# EAGLE design led-tester (EAGLE 7.3.0)
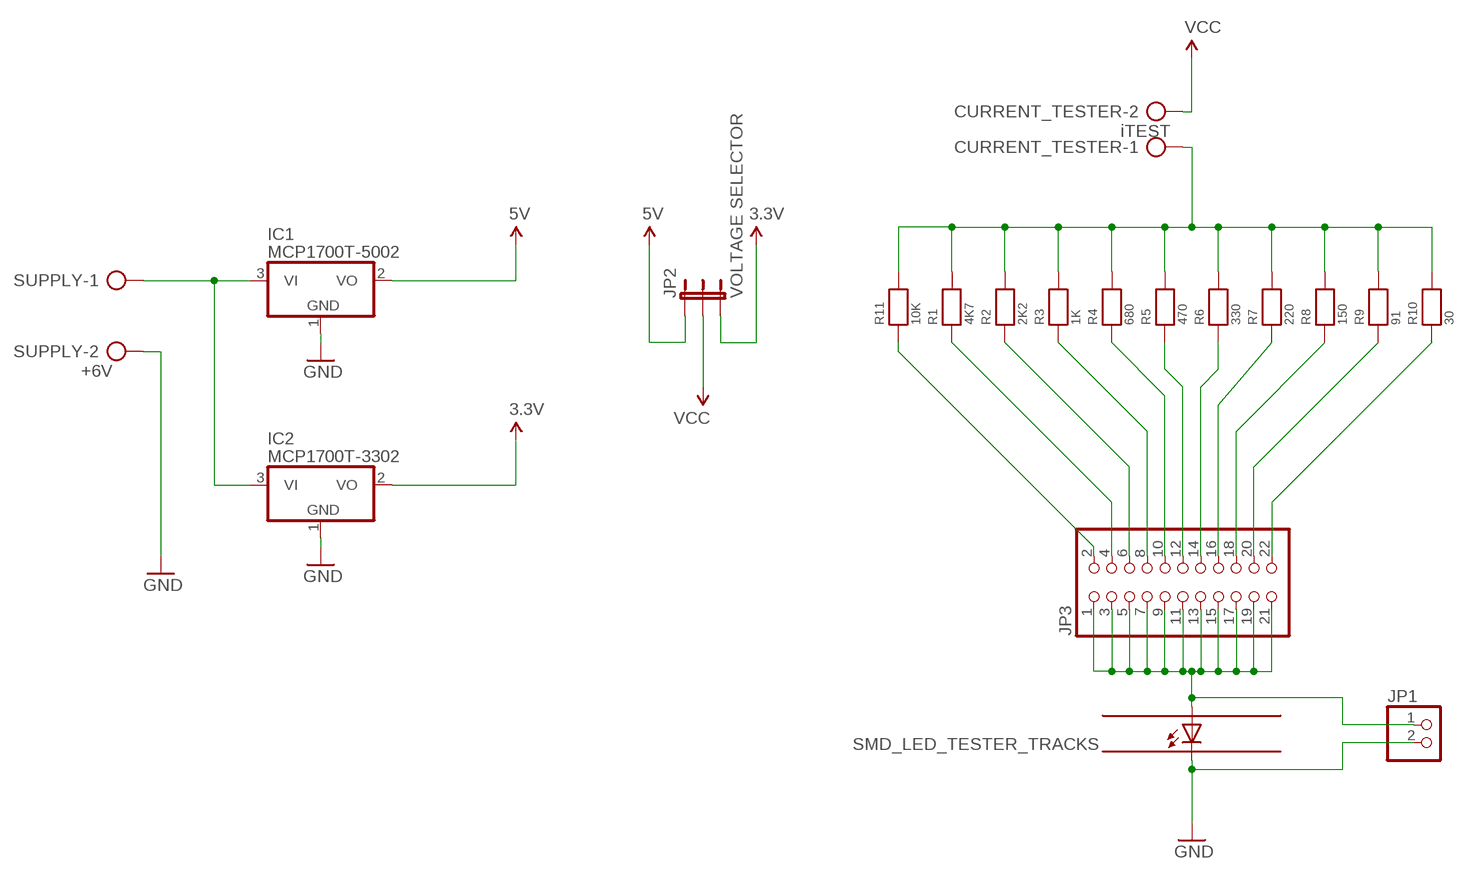
[diagram p0: schematic, sheet 1]

## Parts
CURRENT_TESTER  iTEST  TERMINAL_BLOCK_X2  [TERMINAL_BLOCK_X2]
IC1  MCP1700T-5002  MCP1703CB  [SOT23]
IC2  MCP1700T-3302  MCP1703CB  [SOT23]
JP1  PINHD-1X2  [1X02]
JP2  VOLTAGE SELECTOR  JUMPER-3PTH  [1X03]
JP3  PINHD-2X11  [2X11]
R1  4K7  RESISTOR0805  [0805]
R2  2K2  RESISTOR0805  [0805]
R3  1K  RESISTOR0805  [0805]
R4  680  RESISTOR0805  [0805]
R5  470  RESISTOR0805  [0805]
R6  330  RESISTOR0805  [0805]
R7  220  RESISTOR0805  [0805]
R8  150  RESISTOR0805  [0805]
R9  91  RESISTOR0805  [0805]
R10  30  RESISTOR0805  [0805]
R11  10K  RESISTOR0805  [0805]
SUPPLY  +6V  TERMINAL_BLOCK_X2  [TERMINAL_BLOCK_X2]
U$1  SMD_LED_TESTER_TRACKS  [SMD_LED_TESTER_TRACKS]

## Nets
3.3V: IC2.2(VO) JP2.3
5V: IC1.2(VO) JP2.1
GND: IC1.1(GND) IC2.1(GND) JP1.2 SUPPLY.2 U$1.P$2(C)
N$1: JP3.22 R10.1
N$2: JP3.20 R9.1
N$3: JP3.18 R8.1
N$4: JP3.16 R7.1
N$5: JP3.14 R6.1
N$6: JP3.12 R5.1
N$7: JP3.10 R4.1
N$8: JP3.8 R3.1
N$9: JP3.6 R2.1
N$10: JP3.4 R1.1
N$11: JP1.1 JP3.1 JP3.3 JP3.5 JP3.7 JP3.9 JP3.11 JP3.13 JP3.15 JP3.17 JP3.19 JP3.21 U$1.P$1(A)
N$12: JP3.2 R11.1
N$13: CURRENT_TESTER.1 R1.2 R2.2 R3.2 R4.2 R5.2 R6.2 R7.2 R8.2 R9.2 R10.2 R11.2
N$15: IC1.3(VI) IC2.3(VI) SUPPLY.1
VCC: CURRENT_TESTER.2 JP2.2

## Library data of the parts
CURRENT_TESTER SUPPLY = kalanda:TERMINAL_BLOCK_X2: CONNECTOR; OC_FARNELL: unknown; OC_NEWARK: unknown
IC1 IC2 = linear:MCP1703: 250 mA, 16V, Low Quiescent Current LDO Regulator Source: http://ww1.microchip.com/downloads/en/DeviceDoc/22049b.pdf
JP1 = pinhead:PINHD-1X2: PIN HEADER
JP2 = SparkFun-Passives:JUMPER-3
JP3 = pinhead:PINHD-2X11: PIN HEADER
R1-R11 = microbuilder:RESISTOR: Resistors 0402 - 0402 Surface Mount Package 22 Ohm 1% 1/16W [Digikey: 311-22.0LRTR-ND] 33 Ohm 5% 1/16W 1.0K 5% 1/16W 1.5K 5% 1/16W 2.0K 1% 1/16W 10.0K 1% 1/16W [Digikey: 311-10.0KLRTR-ND] 10.0K 5% 1/16W [Digikey: RMCF0402JT10K0TR-ND] 12.1K 1% 1/16W [Digikey: 311-22.0LRTR-ND] 100.0K 5% 1/16W 0603 - 0603 Surface Mount Package 0 Ohm 1/10 Watt 1% Resistor 15 Ohm 1/10 Watt 1% Resistor 33 Ohm 1/10 Watt 1% Resistor 49.9 Ohm 1/10 Watt 1% Resistor 100 Ohm 1/10 Watt 1% Resistor 150 Ohm 1/10 Watt 1% Resistor 240 Ohm 1/10 Watt 1% Resistor 390 Ohm 1/10 Watt 1% Resistor 560 Ohm 1/10 Watt 1% Resistor 680 Ohm 1/10 Watt 1% Resistor 750 Ohm 1/10 Watt 1% Resistor 1.0K Ohm 1/10 Watt 1% Resistor 1.5K Ohm 1/10 Watt 1% Resistor 2.0K Ohm 1/10 Watt 1% Resistor 2.2K Ohm 1/10 Watt 1% Resistor 3.3K Ohm 1/10 Watt 1% Resistor 4.7K Ohm 1/10 Watt 1% Resistor 10.0K Ohm 1/10 Watt 1% Resistor 12.0K Ohm 1/10 Watt 1% Resistor 12.1K Ohm 1/10 Watt 1% Resistor 20.0K Ohm 1/10 Watt 1% Resistor 33.0K Ohm 1/10 Watt 1% Resistor 100.0K Ohm 1/10 Watt 1% Resistor 0805 - 0805 Surface Mount Package 0 Ohm 1/8 Watt 1% Resistor 33 Ohm 1/8 Watt 1% Resistor 100 Ohm 1/8 Watt 1% Resistor 150 Ohm 1/8 Watt 1% Resistor 200 Ohm 1/8 Watt 1% Resistor 240 Ohm 1/8 Watt 1% Resistor 330 Ohm 1/8 Watt 1% Resistor 390 Ohm 1/8 Watt 1% Resistor 470 Ohm 1/8 Watt 1% Resistor 1.0K Ohm 1/8 Watt 1% Resistor 1.5K Ohm 1/8 Watt 1% Resistor 2.0K Ohm 1/8 Watt 1% Resistor 4.7K Ohm 1/8 Watt 1% Resistor 5.1K Ohm 1/8 Watt 1% Resistor 5.6K Ohm 1/8 Watt 1% Resistor 10.0K Ohm 1/8 Watt 1% Resistor 22.0K Ohm 1/8 Watt 1% Resistor 33.0K Ohm 1/8 Watt 1% Resistor 100K Ohm 1/8 Watt 1% Resistor 1206 - 1206 Surface Mount Package 2012 - 2010 Surface Mount Package 0.11 Ohm 1/2 Watt 1% Resistor - Digikey: RHM.11UCT-ND
U$1 = kalanda:SMD_LED_TESTER_TRACKS

## Board
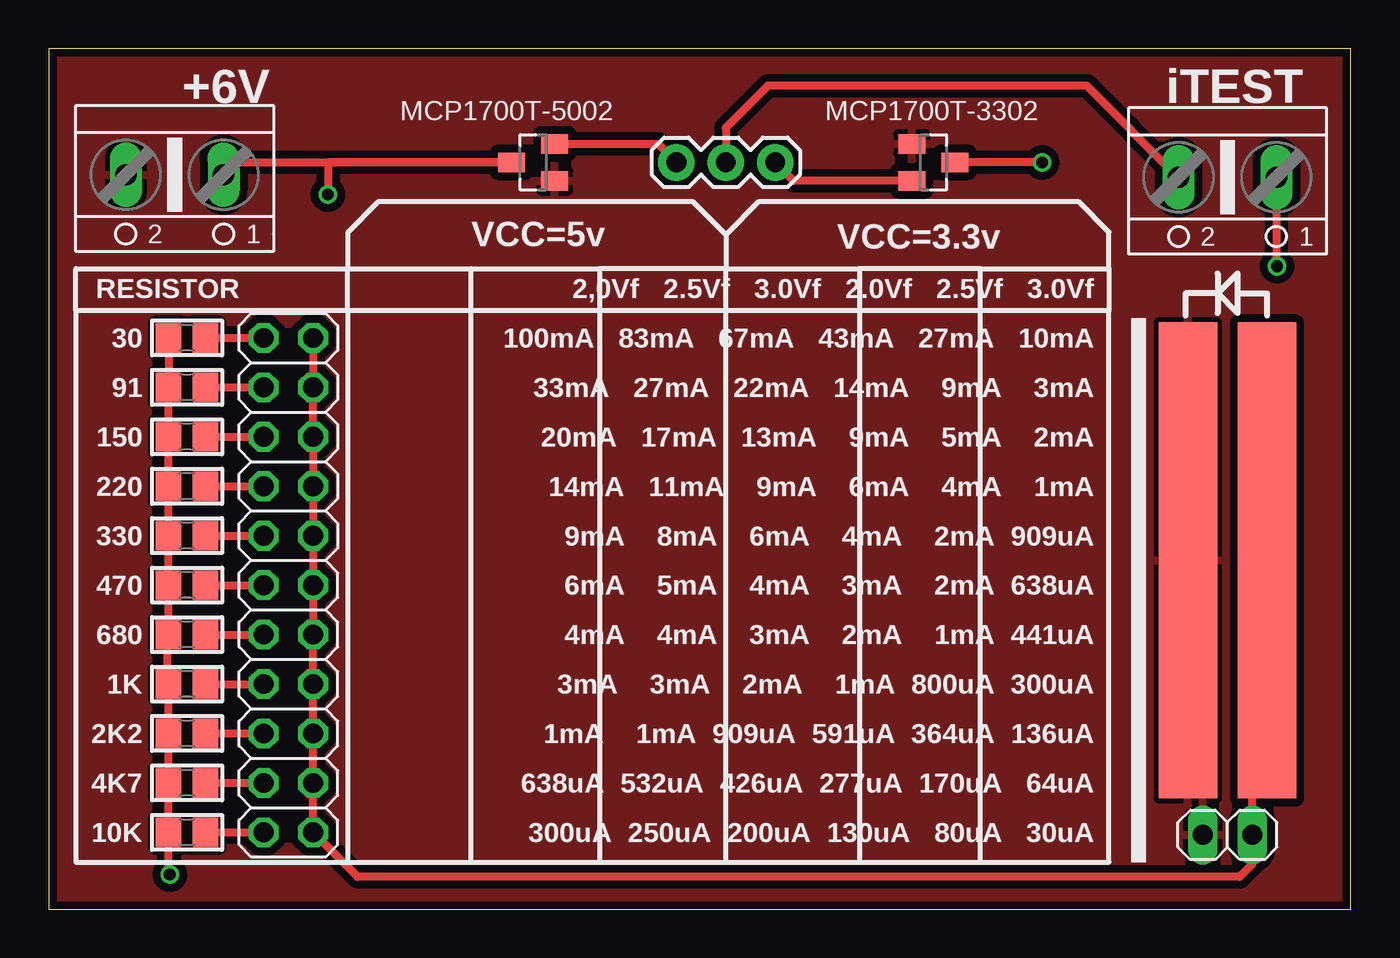
[diagram p1: board, top side]
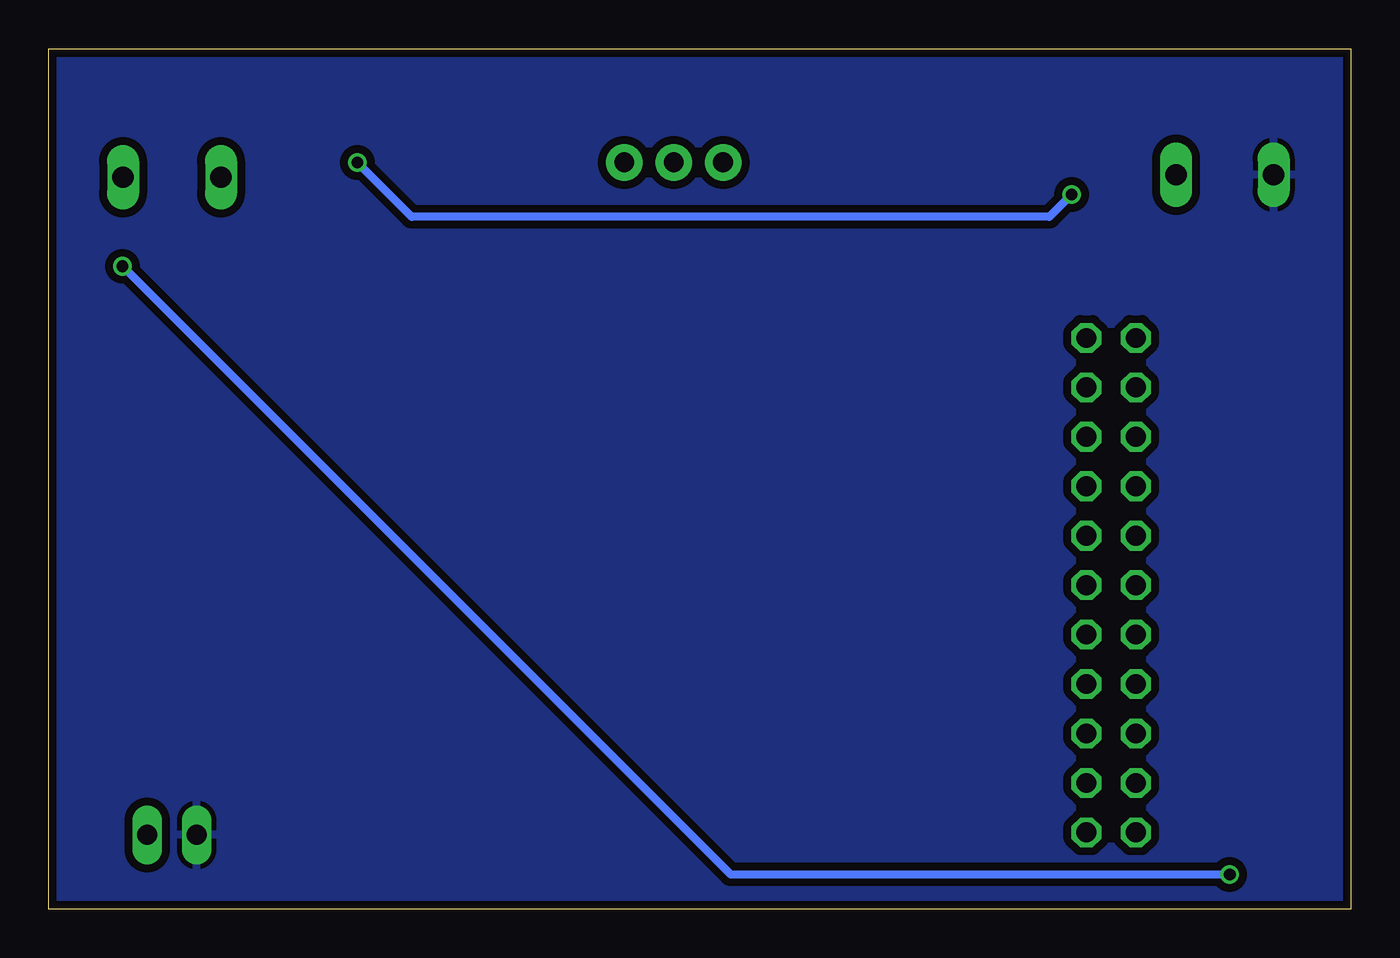
[diagram p2: board, bottom side, seen from below]

Size 66.92 x 44.2 mm. Coordinates in mm from the lower left corner, seen from the top.
Outline: 0,44.2 0,0 66.92,0 66.92,44.2 0,44.2
Copper layers (1*16): Top 0.0356mm / dielectric 1.5011mm / Bottom 0.0356mm
Design rules "LaenPCBOrder": minimum track width 6mil, minimum drill 13mil, track to track 6mil, track to pad 6mil, pad to pad 6mil, via to via 6mil, smd to smd 6mil, copper to edge 15mil, drill to drill 6mil, minimum pad ring 7mil, minimum via ring 7mil, stop-mask expansion 3mil, vias tented up to drill 0mil, thermal gap 10mil

### Footprints (pad centres in the part's own frame; a part is rotated, then mirrored left to right if it is on the bottom)
TERMINAL_BLOCK_X2 = drill 1.1 long: 1 -2.515,0; 2 2.515,0
SOT23 = smd 1 x 1.4: 1 -0.95,-1.1; 2 0.95,-1.1; 3 0,1.1
1X02 = drill 1.016 long: 1 -1.27,0; 2 1.27,0
1X03 = drill 1.016 pad 1.88: 1 0,0; 2 2.54,0; 3 5.08,0
2X11 = drill 1.016 octagon: 1 -12.7,-1.27; 2 -12.7,1.27; 3 -10.16,-1.27; 4 -10.16,1.27; 5 -7.62,-1.27; 6 -7.62,1.27; 7 -5.08,-1.27; 8 -5.08,1.27; 9 -2.54,-1.27; 10 -2.54,1.27; 11 0,-1.27; 12 0,1.27; 13 2.54,-1.27; 14 2.54,1.27; 15 5.08,-1.27; 16 5.08,1.27; 17 7.62,-1.27; 18 7.62,1.27; 19 10.16,-1.27; 20 10.16,1.27; 21 12.7,-1.27; 22 12.7,1.27
0805 = smd 1.3 x 1.5: 1 -0.95,0; 2 0.95,0
SMD_LED_TESTER_TRACKS = smd 24.452 x 3: P$1 0,2.032; P$2 0,-2.032

### Placement (x,y rotation side)
CURRENT_TESTER  60.58,37.59 180 top
IC1  24.89,38.35 90 top
IC2  45.47,38.35 270 top
JP1  60.58,3.81 180 top
JP2  32.26,38.35 0 top
JP3  12.32,16.64 90 top
R1  7.11,6.48 180 top
R2  7.11,9.02 180 top
R3  7.11,11.56 180 top
R4  7.11,14.1 180 top
R5  7.11,16.64 180 top
R6  7.11,19.18 180 top
R7  7.11,21.72 180 top
R8  7.11,24.26 180 top
R9  7.11,26.8 180 top
R10  7.11,29.34 180 top
R11  7.11,3.94 180 top
SUPPLY  6.48,37.72 180 top
U$1  60.58,17.91 270 top

### Tracks (layer width: path | path; a pad name or v marks a point on that pad's centre or on a via)
3.3V
  Top 0.406: IC2.2 38.29,37.4 JP2.3
5V
  Top 0.406: IC1.2 31.31,39.3 JP2.1
GND
  pour Top (isolate 0.406): 66.8,44.07 66.8,0.13 -0.13,0.25 -0.13,44.2
  pour Bottom (isolate 0.406): 66.8,44.07 66.55,0.25 0.13,0.25 0.25,43.94
N$1
  Top 0.406: R10.1 JP3.22
N$2
  Top 0.406: R9.1 JP3.20
N$3
  Top 0.406: R8.1 JP3.18
N$4
  Top 0.406: R7.1 JP3.16
N$5
  Top 0.406: R6.1 JP3.14
N$6
  Top 0.406: R5.1 JP3.12
N$7
  Top 0.406: R4.1 JP3.10
N$8
  Top 0.406: R3.1 JP3.8
N$9
  Top 0.406: R2.1 JP3.6
N$10
  Top 0.406: R1.1 JP3.4
N$11
  Top 0.406: JP3.21 JP3.19 JP3.17 JP3.15 JP3.13 JP3.11 JP3.9 JP3.7 JP3.5 JP3.3 JP3.1 15.88,1.65 61.2,1.65 61.85,2.3 JP1.1 61.85,17.65 62.1,17.91 U$1.P$1
N$12
  Top 0.406: R11.1 JP3.2
N$13  (via drill 0.6)
  Top 0.406: R10.2 R9.2 R8.2 R7.2 R6.2 R5.2 R4.2 6.16,14.41 6.1,14.48 6.1,11.62 R3.2 R2.2 R1.2 R11.2 6.16,1.71 v6.22,1.78 | CURRENT_TESTER.1 63.09,33.05 v63.12,33.02
  Bottom 0.406: v63.12,33.02 31.88,1.78 v6.22,1.78
N$15  (via drill 0.6)
  Top 0.406: SUPPLY.1 9.63,38.35 IC1.3 14.35,38.35 v14.35,36.7 | v51.05,38.35 IC2.3
  Bottom 0.406: v14.35,36.7 15.49,35.56 48.26,35.56 v51.05,38.35
VCC
  Top 0.406: CURRENT_TESTER.2 58.04,37.59 53.34,42.29 36.96,42.29 34.8,40.13 JP2.2

### Text on the board
tPlace: VCC=5v | VCC=3.3v | 2,0Vf 2.5Vf 3.0Vf 2.0Vf 2.5Vf 3.0Vf / 100mA 83mA 67mA 43mA 27mA 10mA / 33mA 27mA 22mA 14mA 9mA 3mA / 20mA 17mA 13mA 9mA 5mA 2mA / 14mA 11mA 9mA 6mA 4mA 1mA / 9mA 8mA 6mA 4mA 2mA 909uA / 6mA 5mA 4mA 3mA 2mA 638uA / 4mA 4mA 3mA 2mA 1mA 441uA / 3mA 3mA 2mA 1mA 800uA 300uA / 1mA 1mA 909uA 591uA 364uA 136uA / 638uA 532uA 426uA 277uA 170uA 64uA / 300uA 250uA 200uA 130uA 80uA 30uA | RESISTOR